# Altium schematic sheet Power.SchDoc
size A4; SheetNumber: 2; SheetTotal: 5
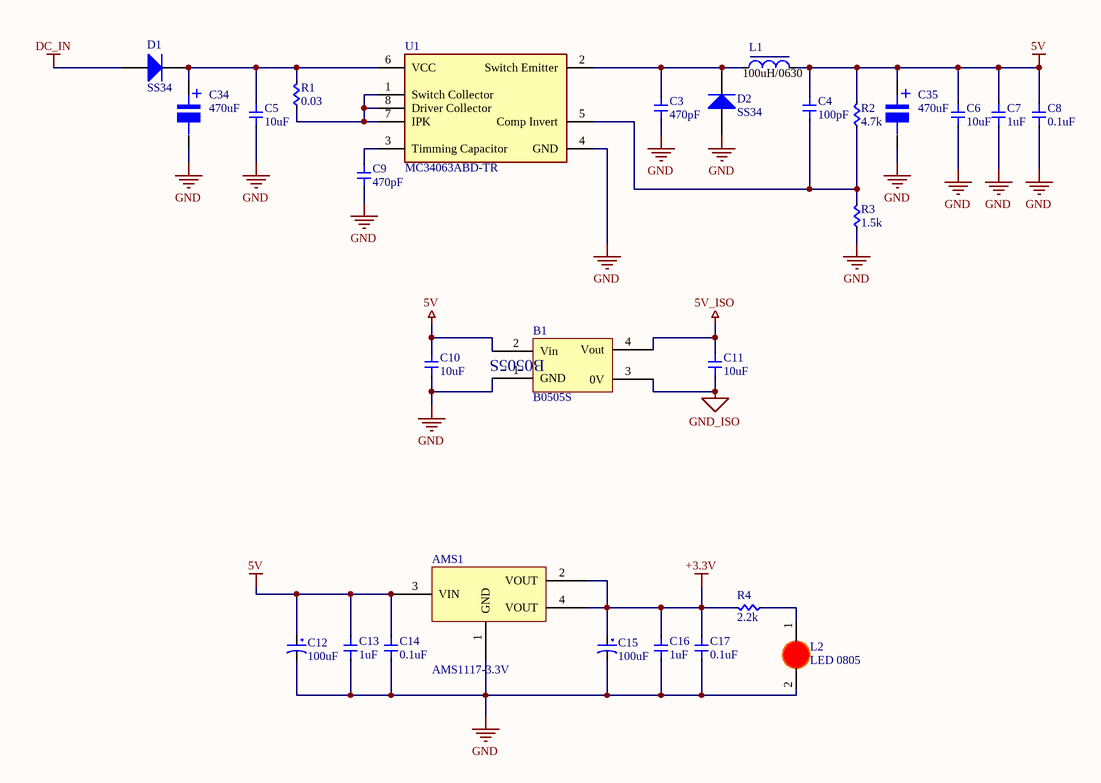
[diagram p0: Power.SchDoc]

## Parts
AMS1  AMS1117-3.3V  [SOT223]
B1  B0505S  [B0505S]
C3  470pF  [Cap 0603]
C4  100pF  [Cap 0603]
C5  10uF  [Cap 1206]
C6  10uF  [Cap 1206]
C7  1uF  [Cap 0603]
C8  0.1uF  [Cap 0603]
C9  470pF  [Cap 0603]
C10  10uF  [Cap 1206]
C11  10uF  [Cap 1206]
C12  100uF  [tu tantalum smd7343]
C13  1uF  [Cap 0603]
C14  0.1uF  [Cap 0603]
C15  100uF  [tu tantalum smd7343]
C16  1uF  [Cap 0603]
C17  0.1uF  [Cap 0603]
C34  470uF  [tu nhom 8 (f)]
C35  470uF  [tu nhom 8 (f)]
D1  SS34  [DIODE SMA]
D2  SS34  [DIODE SMA]
L1  100uH/0630  [INDUCTOR_0630SMD]
L2  LED 0805  [LED-0805-Red]
R1  0.03  [RES 0805]
R2  4.7k  [RES 0603]
R3  1.5k  [RES 0603]
R4  2.2k  [RES 0603]
U1  MC34063ABD-TR  [SOP 8]

## Nets
5V: AMS1.3(VIN) B1.2(Vin) C4.1 C6.1 C7.1 C8.1 C10.1 C12.1 C13.1 C14.1 C35.1 L1.2 R2.2
5V_ISO: B1.4(Vout) C11.1
+3.3V: AMS1.2(VOUT) AMS1.4(VOUT) C15.1 C16.1 C17.1 R4.2
DC_IN: D1.1(A)
GND: AMS1.1(GND) B1.1(GND) C3.2 C5.2 C6.2 C7.2 C8.2 C9.2 C10.2 C12.2 C13.2 C14.2 C15.2 C16.2 C17.2 C34.2 C35.2 D2.1(A) L2.2(K) R3.1 U1.4(GND)
GND_ISO: B1.3(0V) C11.2
NetC3_1: C3.1 D2.2(K) L1.1 U1.2(Switch_Emitter)
NetC4_2: C4.2 R2.1 R3.2 U1.5(Comp_Invert)
NetC5_1: C5.1 C34.1 D1.2(K) R1.2 U1.6(VCC)
NetC9_1: C9.1 U1.3(Timming_Capacitor)
NetL2_1: L2.1(A) R4.1
NetR1_1: R1.1 U1.1(Switch_Collector) U1.7(IPK) U1.8(Driver_Collector)

## Notes on the sheet
- (in symbol Tu Nhom 470uF 16V) +

## Library data of the parts
AMS1 = AMS1117 SMD: Dán; Value: AMS1117-3.3V SOT223; Don_Vi: Con; Ma_Hang: MH000596; Ghi_Chu: *; Kieu_Chan: *; Chung_Loai: Dán
B1 = B0505S: Cắm; Ten_Linh_Kien: B0505S-1W SIP4 IC Converter DC-DC; Don_Vi: Con; Ma_Hang: MH003143; Ghi_Chu: *; Kieu_Chan: *; Chung_Loai: Cắm
C3 C4 C7-C9 C13 C14 C16 C17 = Cap 0603: Capacitor SMD 0603
C5 C6 C10 C11 = Cap 1206: Capacitor SMD 1206
C12 C15 = Tu tantalum 100uF 25V SMD7343: Dán; Don_Vi: Con; So_Chan: 2; Ten_Linh_Kien: Tụ tantalum 107E-100uF 25V SMD7343; Ma_Hang: MH002347; Chung_Loai: Dán; Kieu_Chan: *
C34 C35 = Tu Nhom 470uF 16V: Dán; Don_Vi: Con; So_Chan: 2; Ten_Linh_Kien: Tụ Nhôm 470uF 16V 8x10.4MM; Ma_Hang: MH001940; Chung_Loai: Dán; Kieu_Chan: *
D1 D2 = Diode SS34 ( 1N5822 ): Dán; Don_Vi: Con; Ma_Hang: MH002104; Ten_Linh_Kien: Diode SS34 3A 40V SMA ( 1N5822 SS34A); Kieu_Chan: *; Chung_Loai: Dán
L1 = Inductor Ferrite: Smd Inductors; Code_IEC: 1005; Vendor: Digikey; Published: 8-Jun-2000; LatestRevisionDate: 17-Jul-2002; LatestRevisionNote: Re-released for DXP Platform.; PackageReference: 0402-A; Publisher: Altium Limited; Code_JEITA: 0402; ComponentLink1Description: Digikey Part Link; ComponentLink2Description: Open Datasheet; ComponentLink2URL: H:\LIBRARY\LIBRARY.Datasheet\; Value: 100uH/0630
L2 = LED 0805 Do: Dán; Don_Vi: Con; Ma_Hang: MH000897; Ten_Linh_Kien: LED 0805 Màu Đỏ (Red); Ghi_Chu: *; Kieu_Chan: *; Chung_Loai: Dán
R1 = RES 0805: RES SMD 0805; Manufacturer: Vishay Dale; Manufacturer Part Number: CRCW040210K0FKED; Resistance (Ohms): 10k; Tolerance: ±1%; Power (Watts): 0.063W, 1/16W; Temperature Coefficient: ±100ppm/°C; Supplier 1: Digi-Key; RoHS: RoHS Compliant; Category: Resistors; Stock 1: 2392462; Pricing 1: 10=0.083, 50=0.0444, 200=0.0255, 1000=0.0174 (USD); Packaging: Cut Tape (CT); Composition: Thick Film; Features: Automotive AEC-Q200; Operating Temperature: -55°C ~ 155°C; Package / Case: 0402 (1005 Metric); Supplier Device Package: 0402 (1005 Metric); Size / Dimension: 0.039" L x 0.020" W (1.00mm x 0.50mm); Height: 0.016" (0.40mm); Number of Terminations: 2; ComponentLink1URL: http://www.vishay.com/docs/20035/dcrcwe3.pdf; ComponentLink1Description: http://www.vishay.com/docs/20035/dcrcwe3.pdf; Supplier Part Number 1: 541-10.0KLCT-ND
R2-R4 = RES 0603: RES SMD 0603; Manufacturer: Vishay Dale; Manufacturer Part Number: CRCW040210K0FKED; Resistance (Ohms): 10k; Tolerance: ±1%; Power (Watts): 0.063W, 1/16W; Temperature Coefficient: ±100ppm/°C; Supplier 1: Digi-Key; RoHS: RoHS Compliant; Category: Resistors; Stock 1: 2392462; Pricing 1: 10=0.083, 50=0.0444, 200=0.0255, 1000=0.0174 (USD); Packaging: Cut Tape (CT); Composition: Thick Film; Features: Automotive AEC-Q200; Operating Temperature: -55°C ~ 155°C; Package / Case: 0402 (1005 Metric); Supplier Device Package: 0402 (1005 Metric); Size / Dimension: 0.039" L x 0.020" W (1.00mm x 0.50mm); Height: 0.016" (0.40mm); Number of Terminations: 2; ComponentLink1URL: http://www.vishay.com/docs/20035/dcrcwe3.pdf; ComponentLink1Description: http://www.vishay.com/docs/20035/dcrcwe3.pdf; Supplier Part Number 1: 541-10.0KLCT-ND
U1 = MC34063ABD-TR: Buck, Boost Switching Regulator IC Positive or Negative Adjustable 1.25V 1 Output 1.5A (Switch) 8-SOIC (0.154, 3.90mm Width); MF: STMicroelectronics; SnapEDA_Link: https://www.snapeda.com/parts/MC34063ABD-TR/STMicroelectronics/view-part/?ref=snap; Package: None; Value: *; MP: MC34063ABD-TR; Check_prices: https://www.snapeda.com/parts/MC34063ABD-TR/STMicroelectronics/view-part/?ref=eda